# EasyEDA Pro project libre_oven_devkit.eprj

# Schematic Schematic1
Board Name: Board1; Create Date: 2026-02-06; Page Name: P1; Project Name: libre_oven_devkit; Schematic Name: Schematic1; Update Date: 2026-02-27; Company: EasyEDA.com; Page Size: A4; Version: V1.0
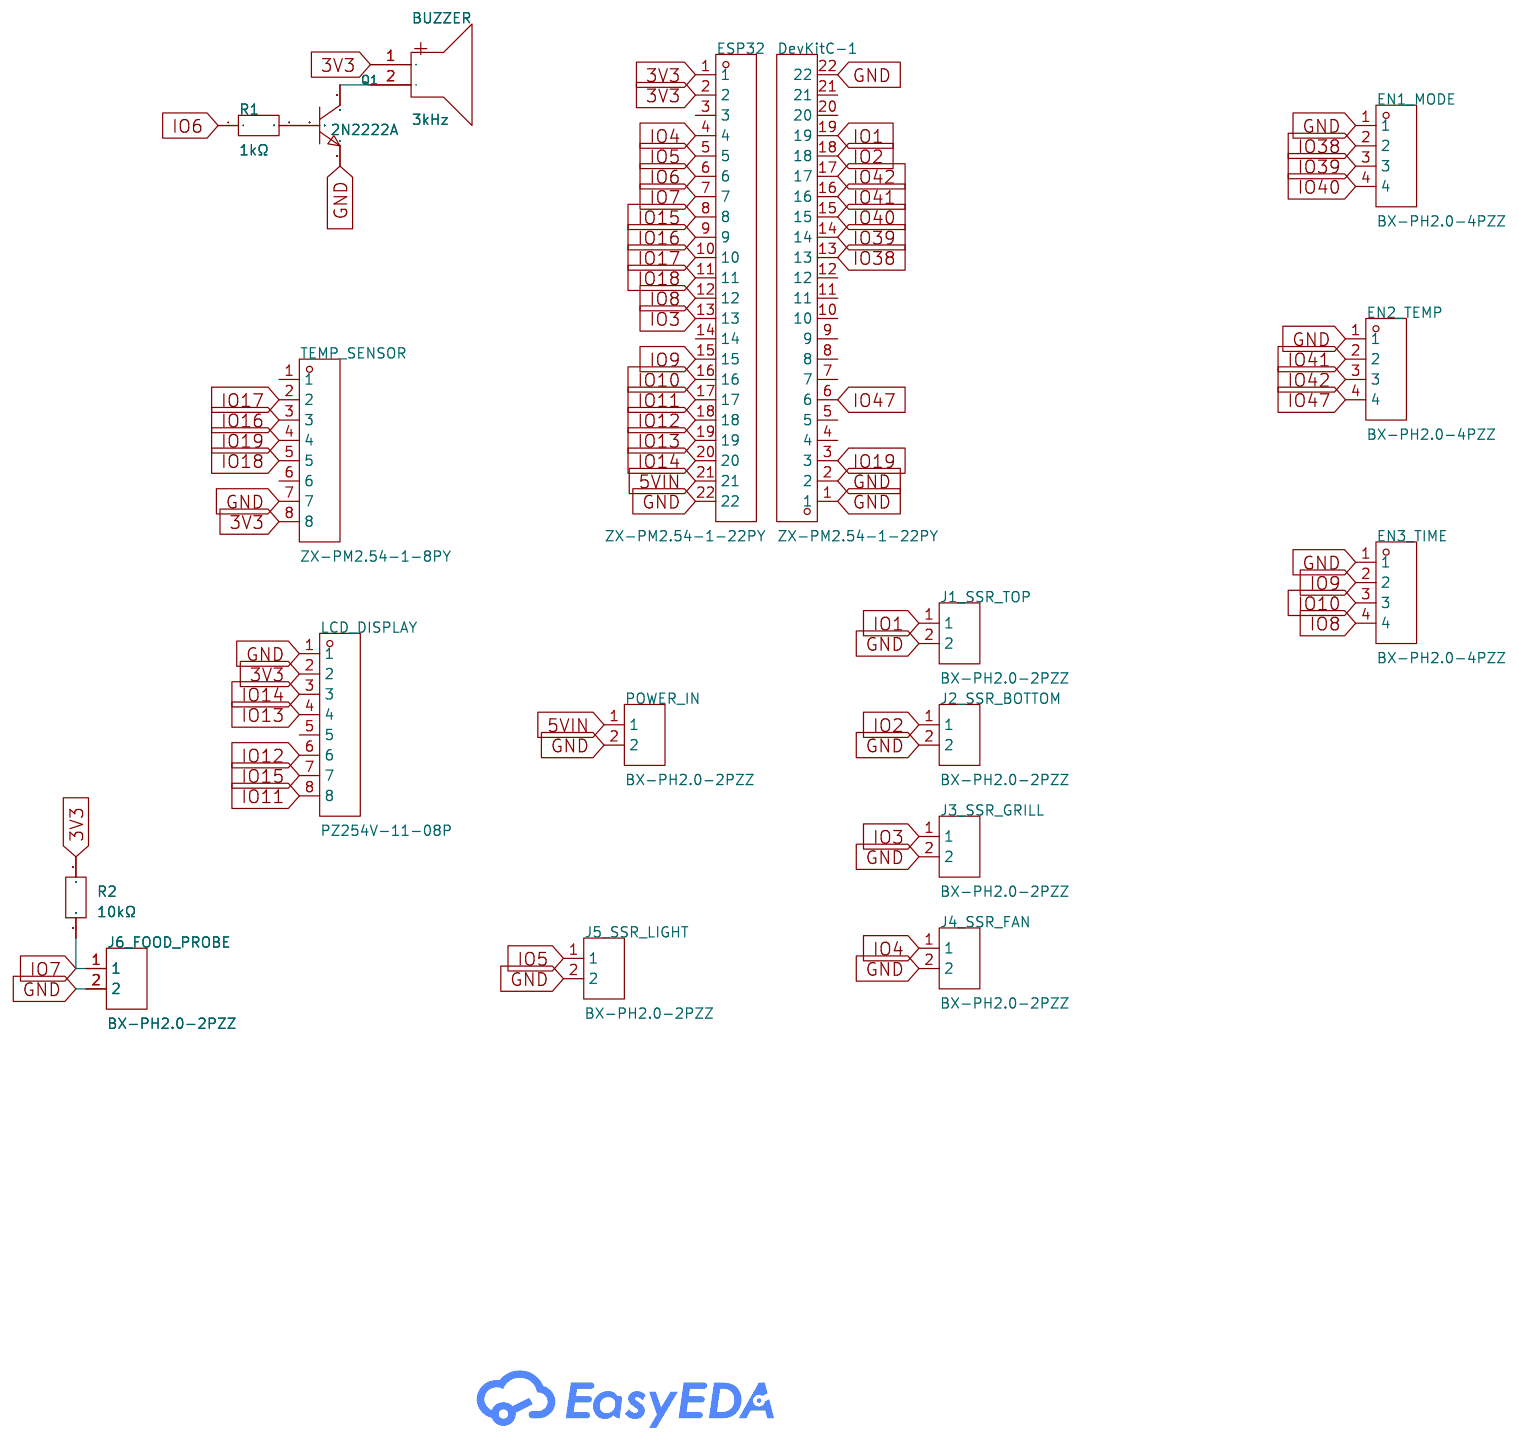
[diagram p0: schematic sheet]

## Parts
BUZZER  3kHz  [BUZ-TH_BD9.0-P5.00-D0.6-FD]
DevKitC-1  ZX-PM2.54-1-22PY  [HDR-TH_22P-P2.54-V-F]
EN1_MODE  BX-PH2.0-4PZZ  [CONN-TH_4P-P2.00_BX-PH2.0-4PZZ]
EN2_TEMP  BX-PH2.0-4PZZ  [CONN-TH_4P-P2.00_BX-PH2.0-4PZZ]
EN3_TIME  BX-PH2.0-4PZZ  [CONN-TH_4P-P2.00_BX-PH2.0-4PZZ]
ESP32  ZX-PM2.54-1-22PY  [HDR-TH_22P-P2.54-V-F]
J1_SSR_TOP  BX-PH2.0-2PZZ  [CONN-TH_2P-P2.00_BOSSIE_BX-PH2.0-2PZZ]
J2_SSR_BOTTOM  BX-PH2.0-2PZZ  [CONN-TH_2P-P2.00_BOSSIE_BX-PH2.0-2PZZ]
J3_SSR_GRILL  BX-PH2.0-2PZZ  [CONN-TH_2P-P2.00_BOSSIE_BX-PH2.0-2PZZ]
J4_SSR_FAN  BX-PH2.0-2PZZ  [CONN-TH_2P-P2.00_BOSSIE_BX-PH2.0-2PZZ]
J5_SSR_LIGHT  BX-PH2.0-2PZZ  [CONN-TH_2P-P2.00_BOSSIE_BX-PH2.0-2PZZ]
J6_FOOD_PROBE  BX-PH2.0-2PZZ  [CONN-TH_2P-P2.00_BOSSIE_BX-PH2.0-2PZZ]
LCD_DISPLAY  PZ254V-11-08P  [HDR-TH_8P-P2.54-V-M]
POWER_IN  BX-PH2.0-2PZZ  [CONN-TH_2P-P2.00_BOSSIE_BX-PH2.0-2PZZ]
Q1  2N2222A  [TO-92-3_L4.9-W3.7-P1.27-L]
R1  1kΩ  [RES-TH_BD2.7-L6.2-P10.20-D0.4]
R2  10kΩ  [RES-TH_BD2.7-L6.2-P10.20-D0.4]
TEMP_SENSOR  ZX-PM2.54-1-8PY  [HDR-TH_8P-P2.54-V-F]

## Library data of the parts
BUZZER = HNB09A03: LCSC Part Name: 电磁式有源一体蜂鸣器HNB09A03; Supplier Part: C96102; Manufacturer: 华能; Supplier Footprint: 插件,D=9mm; JLCPCB Part Class: Extended Part; Datasheet: https://item.szlcsc.com/datasheet/HNB09A03/97306.html; Supplier: LCSC; Driver Circuitry: Active Buzzer (Built-in Driving Circuit); Technology: Electromagnetic; Voltage - Supply: 1.5V~4.5V; Current Consumption: 30mA; Sound Pressure Level(SPL): 85dB; Diameter(φD): 9mm; Height: 5.5mm; Operating Temperature: -20℃~+70℃
DevKitC-1 ESP32 = ZX-PM2.54-1-22PY: LCSC Part Name: 1x22P 间距:2.54mm 直插; Supplier Part: C7499337; Manufacturer: Megastar(兆星); Supplier Footprint: 插件,P=2.54mm; JLCPCB Part Class: Extended Part; Datasheet: https://item.szlcsc.com/datasheet/ZX-PM2.54-1-22PY/8573998.html; Supplier: LCSC; Holes Structure: 1x22P; Pitch: 2.54mm; Circular Hole / Square Hole: Square Hole; Mounting Type: Through Hole; Number of Rows: 1; Number of Positions: 22P; Current Rating: 3A; Holes Direction: Top; Insulation Height: 8.5mm; Contact Material: Brass; Contact Plating: Gold; Operating Temperature: -40℃~+105℃; PIN Length: 3.2mm
EN1_MODE EN2_TEMP EN3_TIME = BX-PH2.0-4PZZ: LCSC Part Name: 1x4P 间距:2mm 直插 系列:PH; Supplier Part: C18077746; Manufacturer: Bossie(博锡); Supplier Footprint: 插件,P=2mm; JLCPCB Part Class: Extended Part; Datasheet: https://item.szlcsc.com/datasheet/BX-PH2.0-4PZZ/19218147.html; Supplier: LCSC; Pins Structure: 1x4P; Pitch: 2mm; Mounting Type: Through Hole; Reference Series: PH; Number of Pins: 4P; Number of Rows: 1; Number of PINs Per Row: 4; Current Rating: 2A; Contact Material: Brass; Contact Plating: Tin; Operating Temperature: -25℃~+85℃; Voltage Rating: 250V; Plastic Material: PA66; Flame Retardant Rating: UL94V-0; Color: White; Z-Height of the Board: 6.05mm; X-Length of Bottom Edge on Board (Spacing Line): 10mm; Y-Width of Bottom Edge on Board: 4.7mm
J1_SSR_TOP J2_SSR_BOTTOM J3_SSR_GRILL J4_SSR_FAN J5_SSR_LIGHT J6_FOOD_PROBE POWER_IN = BX-PH2.0-2PZZ: LCSC Part Name: 1x2P 间距:2mm 直插 系列:PH; Supplier Part: C18077744; Manufacturer: Bossie(博锡); Supplier Footprint: 插件,P=2mm; JLCPCB Part Class: Extended Part; Datasheet: https://item.szlcsc.com/datasheet/BX-PH2.0-2PZZ/19218145.html; Supplier: LCSC; Pins Structure: 1x2P; Pitch: 2mm; Mounting Type: Through Hole; Reference Series: PH; Number of Pins: 2P; Number of Rows: 1; Number of PINs Per Row: 2; Current Rating: 2A; Contact Material: Brass; Contact Plating: Tin; Operating Temperature: -25℃~+85℃; Voltage Rating: 250V; Plastic Material: PA66; Flame Retardant Rating: UL94V-0; Color: White; Z-Height of the Board: 6.05mm; X-Length of Bottom Edge on Board (Spacing Line): 6mm; Y-Width of Bottom Edge on Board: 4.7mm
LCD_DISPLAY = PZ254V-11-08P: LCSC Part Name: 1x8P 间距:2.54mm 方针 直插; Supplier Part: C492407; Manufacturer: XFCN(兴飞); Supplier Footprint: 插件,P=2.54mm; JLCPCB Part Class: Extended Part; Datasheet: https://item.szlcsc.com/datasheet/PZ254V-11-08P/502963.html; Supplier: LCSC; Pin Structure: 1x8P; Pitch: 2.54mm; Circluar Pins/Square Pins: Pin Header; Mounting Type: Through Hole; Number of Rows: 1; Number of Pins: 8P; Length of Mating Pin: 6mm; Insulation Height: 2.5mm; Length of End Connection Pin: 3mm; Contact Material: Brass; Operating Temperature: -40℃~+105℃; Color: Black
Q1 = 2N2222A_C118536: LCSC Part Name: NPN 电流:600mA 电压:40V; Supplier Part: C118536; Manufacturer: ST(先科); Supplier Footprint: TO-92; JLCPCB Part Class: Extended Part; Datasheet: https://item.szlcsc.com/datasheet/2N2222A/119803.html; Supplier: LCSC; type: NPN; Current - Collector(Ic): 600mA; Collector - Emitter Voltage VCEO: 40V; Pd - Power Dissipation: 625mW; DC Current Gain: 40@500mA,10V; Transition frequency(fT): 250MHz; Current - Collector Cutoff: 10nA; Vce Saturation(VCE(sat)): 1V; Emitter-Base Voltage(Vebo): 6V; Number: 1 NPN
R1 R2 = MF1/4W-1K±1%-ST52: LCSC Part Name: 金属膜电阻 1kΩ ±1% 250mW; Supplier Part: C2903245; Manufacturer: VO(翔胜); Supplier Footprint: 插件,D2.7xL6.2mm; JLCPCB Part Class: Extended Part; Datasheet: https://item.szlcsc.com/datasheet/MF1%252F4W-1K%25C2%25B11%2525-ST52/3158996.html; Supplier: LCSC; Type: Metal Film Resistor; Tolerance: ±1%; Voltage-Supply(Max): 250V; Power(Watts): 250mW; Temperature Coefficient: ±100ppm/℃; Operating Temperature: -55℃~+155℃
TEMP_SENSOR = ZX-PM2.54-1-8PY: LCSC Part Name: 1x8P 间距:2.54mm 直插; Supplier Part: C7499328; Manufacturer: Megastar(兆星); Supplier Footprint: 插件,P=2.54mm; JLCPCB Part Class: Extended Part; Datasheet: https://item.szlcsc.com/datasheet/ZX-PM2.54-1-8PY/8573989.html; Supplier: LCSC; Holes Structure: 1x8P; Pitch: 2.54mm; Circular Hole / Square Hole: Square Hole; Mounting Type: Through Hole; Number of Rows: 1; Number of Positions: 8P; Current Rating: 3A; Holes Direction: Top; Insulation Height: 8.5mm; Contact Material: Brass; Contact Plating: Gold; Operating Temperature: -40℃~+105℃; PIN Length: 3.2mm

## Nets
3V3: BUZZER.1(+) ESP32.1 ESP32.2 LCD_DISPLAY.2 R2.1 TEMP_SENSOR.8
5VIN: ESP32.21 POWER_IN.1
GND: DevKitC-1.1 DevKitC-1.2 DevKitC-1.22 EN1_MODE.1 EN2_TEMP.1 EN3_TIME.1 ESP32.22 J1_SSR_TOP.2 J2_SSR_BOTTOM.2 J3_SSR_GRILL.2 J4_SSR_FAN.2 J5_SSR_LIGHT.2 J6_FOOD_PROBE.2 LCD_DISPLAY.1 POWER_IN.2 Q1.1(E) TEMP_SENSOR.7
IO1: DevKitC-1.19 J1_SSR_TOP.1
IO2: DevKitC-1.18 J2_SSR_BOTTOM.1
IO3: ESP32.13 J3_SSR_GRILL.1
IO4: ESP32.4 J4_SSR_FAN.1
IO5: ESP32.5 J5_SSR_LIGHT.1
IO6: ESP32.6 R1.1
IO7: ESP32.7 J6_FOOD_PROBE.1 R2.2
IO8: EN3_TIME.4 ESP32.12
IO9: EN3_TIME.2 ESP32.15
IO10: EN3_TIME.3 ESP32.16
IO11: ESP32.17 LCD_DISPLAY.8
IO12: ESP32.18 LCD_DISPLAY.6
IO13: ESP32.19 LCD_DISPLAY.4
IO14: ESP32.20 LCD_DISPLAY.3
IO15: ESP32.8 LCD_DISPLAY.7
IO16: ESP32.9 TEMP_SENSOR.3
IO17: ESP32.10 TEMP_SENSOR.2
IO18: ESP32.11 TEMP_SENSOR.5
IO19: DevKitC-1.3 TEMP_SENSOR.4
IO38: DevKitC-1.13 EN1_MODE.2
IO39: DevKitC-1.14 EN1_MODE.3
IO40: DevKitC-1.15 EN1_MODE.4
IO41: DevKitC-1.16 EN2_TEMP.2
IO42: DevKitC-1.17 EN2_TEMP.3
IO47: DevKitC-1.6 EN2_TEMP.4
$1N1097: BUZZER.2(-) Q1.3(C)
$1N1205: Q1.2(B) R1.2

Not connected (* = marked no-connect by the designer): DevKitC-1 4 5 7 8 9 10 11 12 20 21; ESP32 3 14; LCD_DISPLAY 5; TEMP_SENSOR 1 6

# Board PCB1
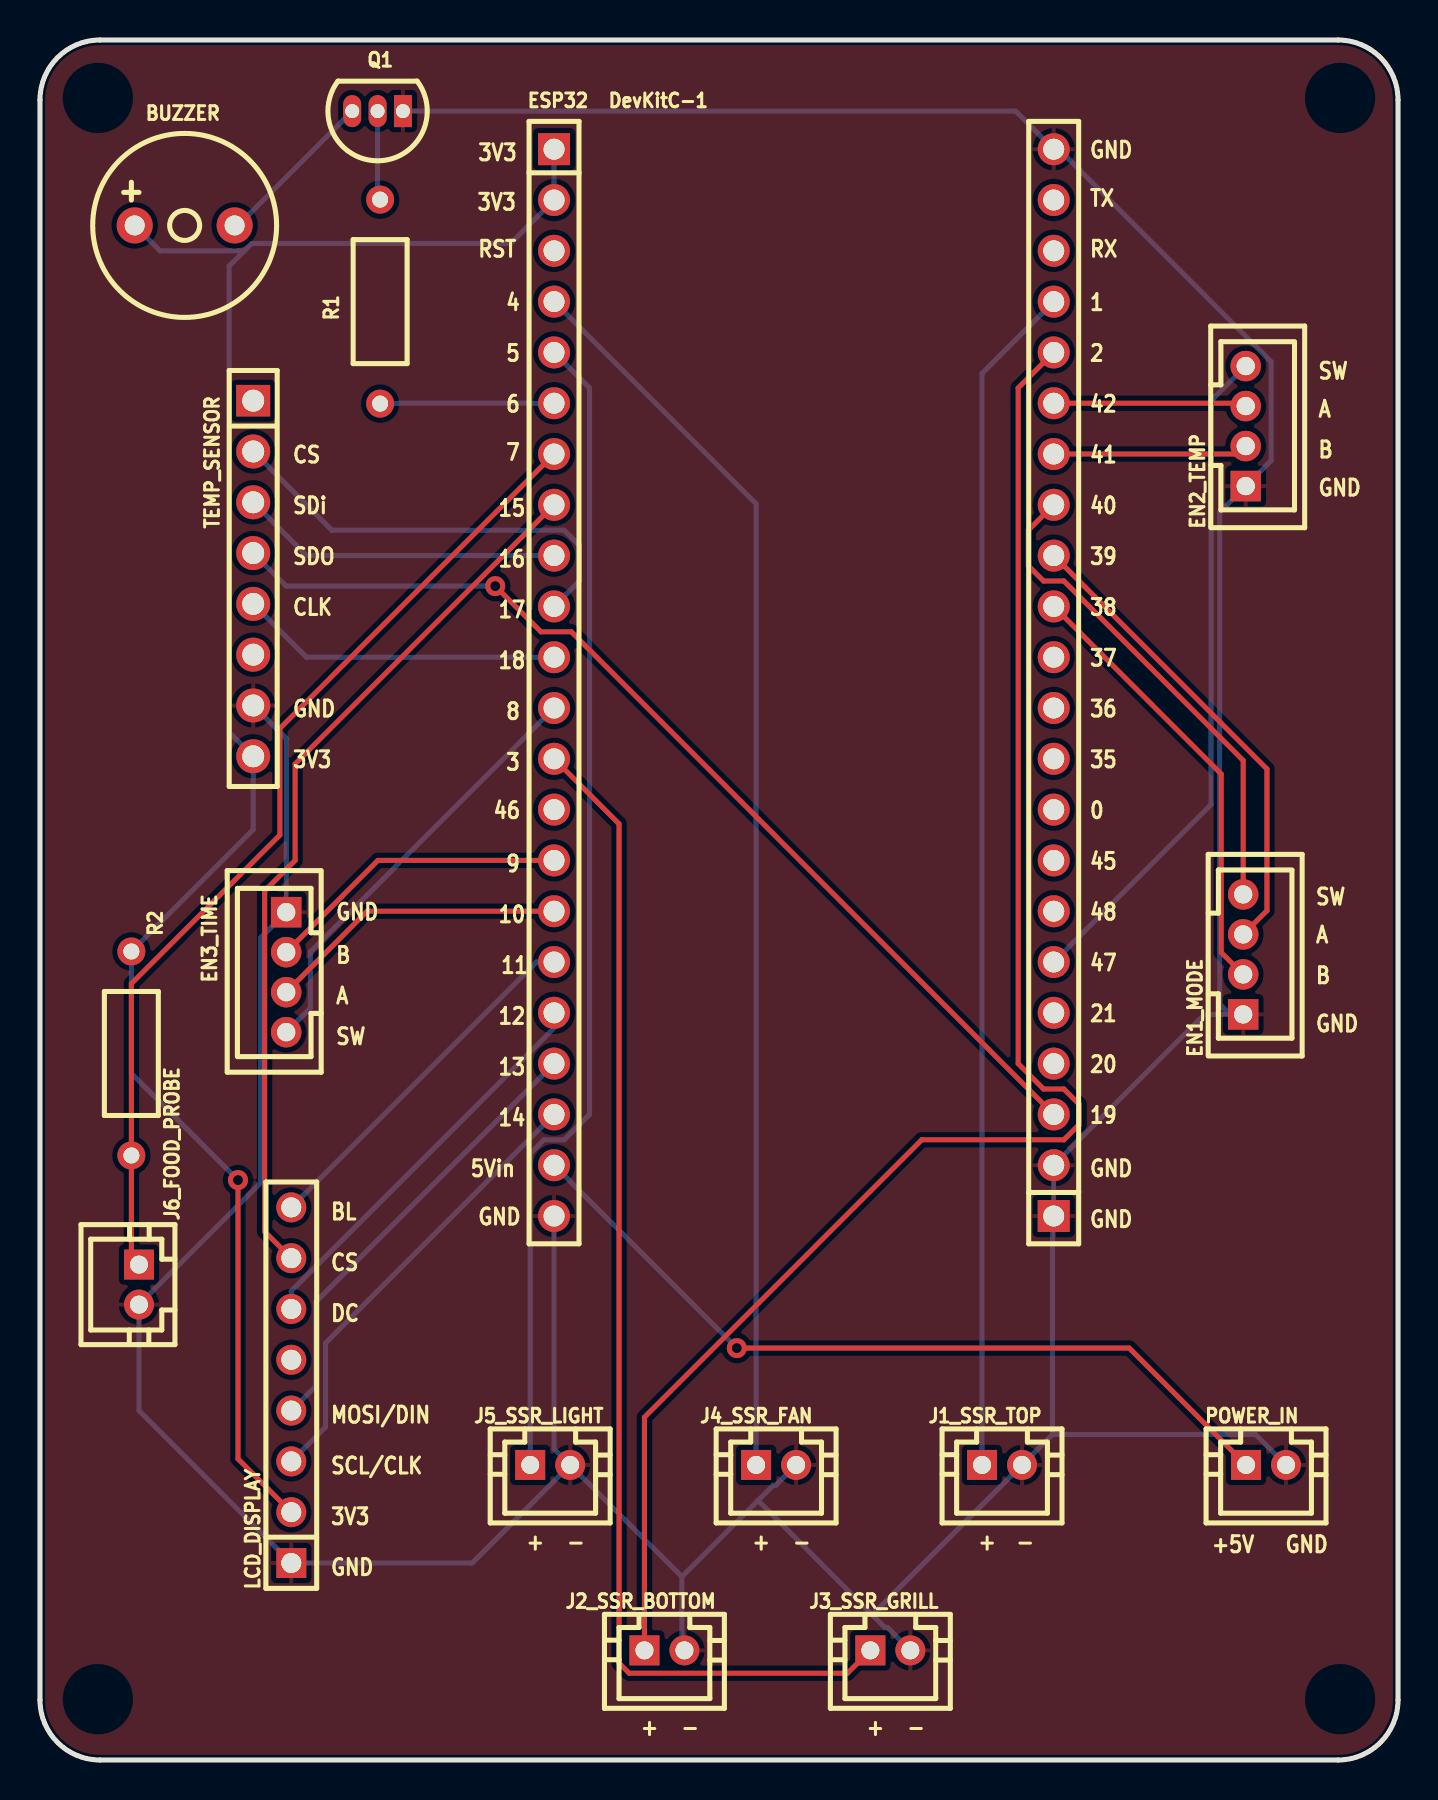
[diagram p1: board, top side]
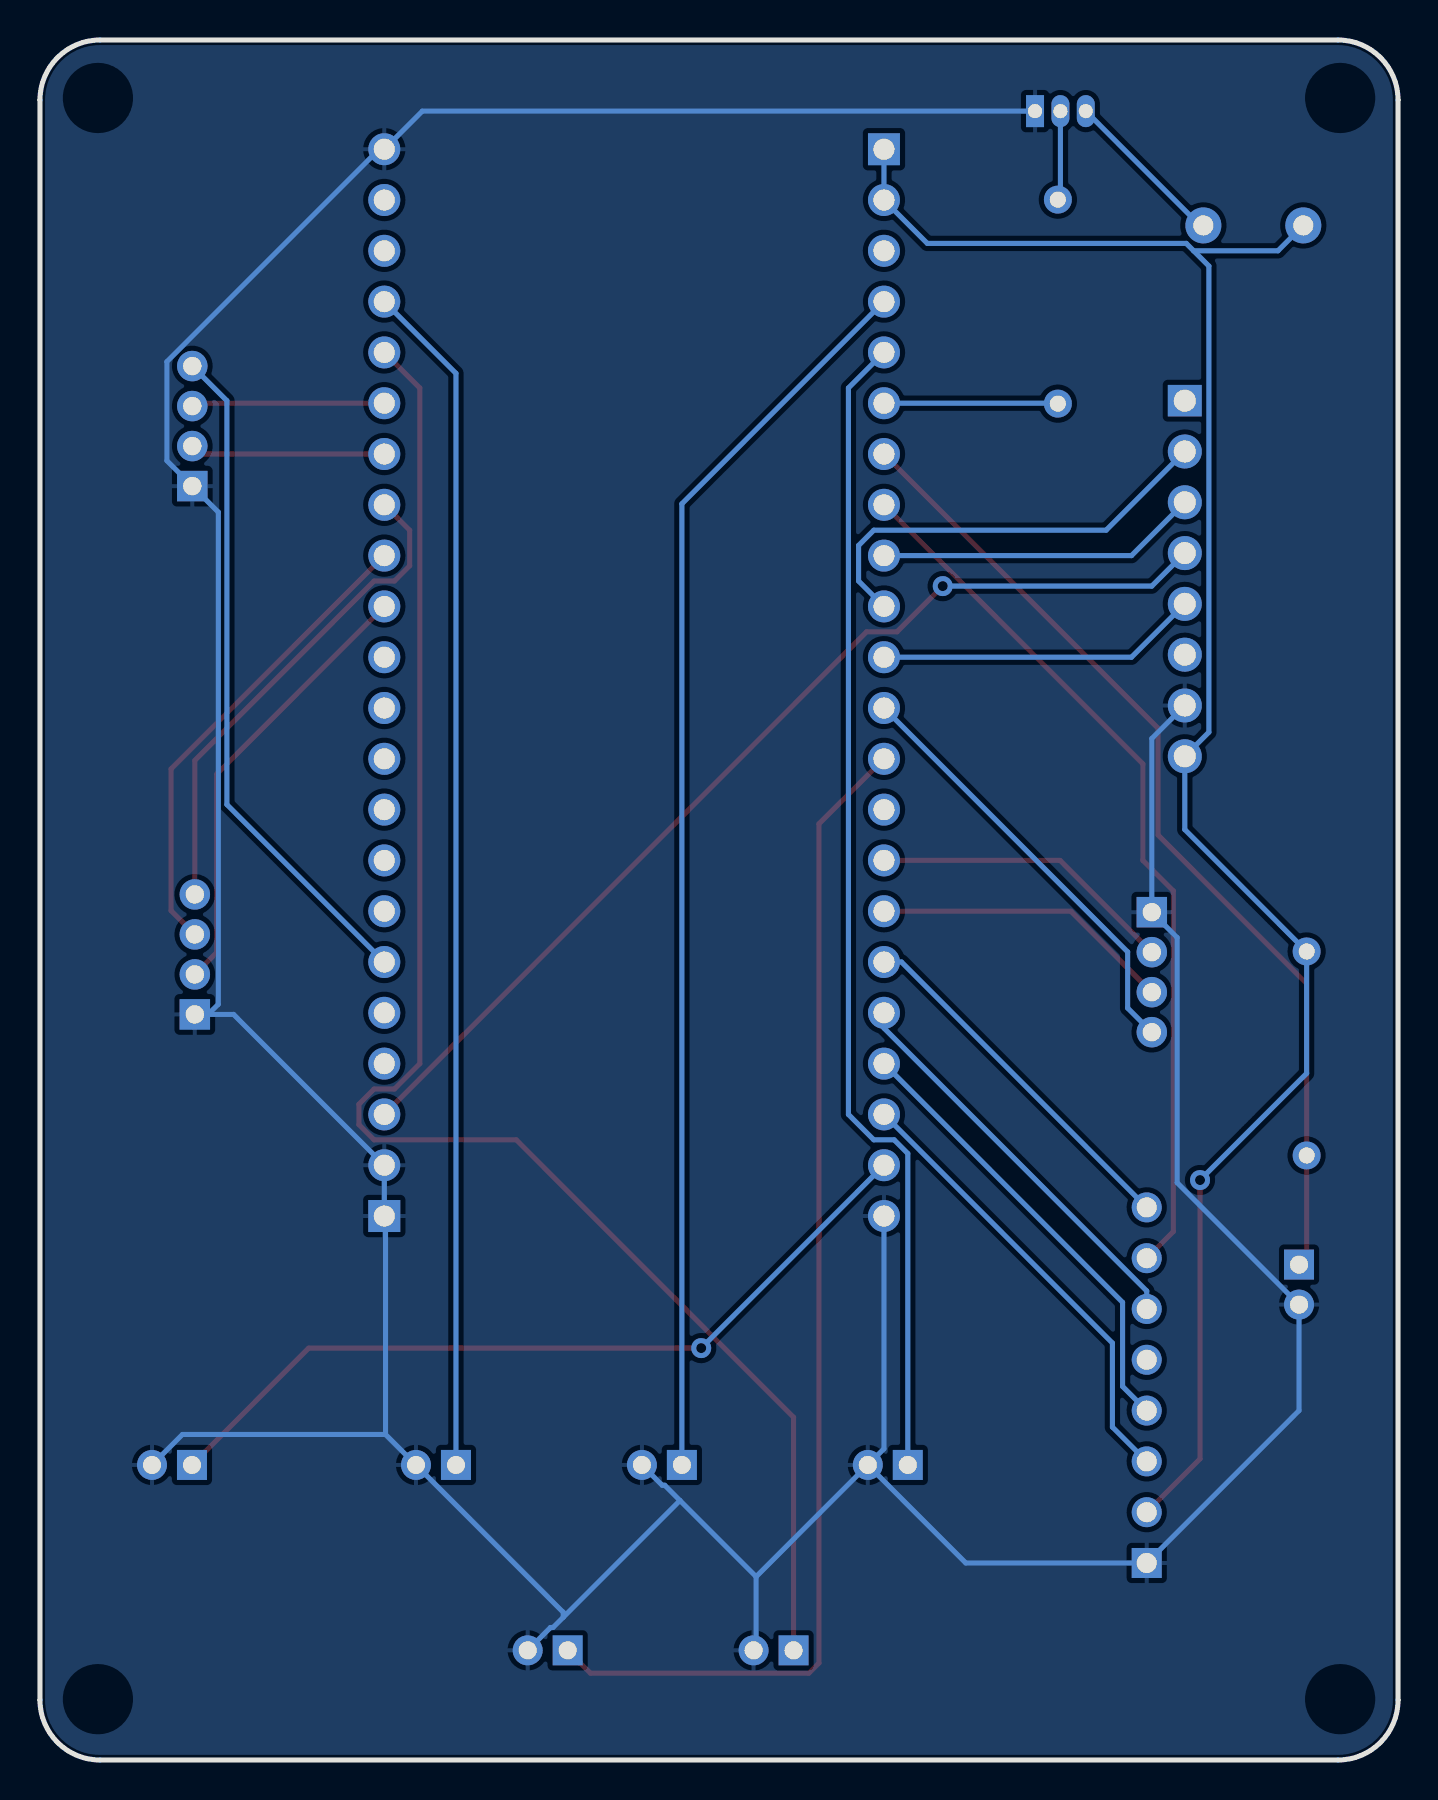
[diagram p2: board, bottom side, seen from below]

Outline 67.94 x 86 mm; copper layers: Top Layer, Bottom Layer. Coordinates in mm from the lower left corner of the outline.
Outline path: 0,83 0,3 arc(0.88,0.88) 3,0 64.94,0 arc(67.07,0.88) 67.94,3 67.94,83 arc(67.07,85.12) 64.94,86 3,86 arc(0.88,85.12) 0,83
Stack: Top Layer 0.035mm / Dielectric1 1.51mm FR4 er 4.5 / Bottom Layer 0.035mm

## Design rules (mm)
template: Custom Config
spacing copperThickness1oz (default): track to track 0.102, other pairs 0.152 to 0.3
spacing copperThickness2oz: track to track 0.203, other pairs 0.152 to 0.3
spacing safeClearance1: track to track 0.4, other pairs 0.152 to 0.3
track width copperThickness1oz (default): min 0.102, default 0.254, max 2.54
track width copperThickness2oz: min 0.203, default 0.254, max 2.54
differential pair differentialPair (default): width min 0.127, default 0.254, max 2.54; gap min 0.152, default 0.152
via viaSize (default): diameter min 0.5, default 1, max 10; hole min 0.3, default 0.5, max 6.3

## Placement (name value [footprint] x y rotation side)
BUZZER  3kHz  [BUZ-TH_BD9.0-P5.00-D0.6-FD]  7.24 76.73 0 top
DevKitC-1  ZX-PM2.54-1-22PY  [HDR-TH_22P-P2.54-V-F]  50.72 53.87 90 top
EN1_MODE  BX-PH2.0-4PZZ  [CONN-TH_4P-P2.00_BX-PH2.0-4PZZ]  60.2 40.28 90 top
EN2_TEMP  BX-PH2.0-4PZZ  [CONN-TH_4P-P2.00_BX-PH2.0-4PZZ]  60.32 66.7 90 top
EN3_TIME  BX-PH2.0-4PZZ  [CONN-TH_4P-P2.00_BX-PH2.0-4PZZ]  12.32 39.39 270 top
ESP32  ZX-PM2.54-1-22PY  [HDR-TH_22P-P2.54-V-F]  25.72 53.87 270 top
J1_SSR_TOP  BX-PH2.0-2PZZ  [CONN-TH_2P-P2.00_BOSSIE_BX-PH2.0-2PZZ]  48.13 14.75 0 top
J2_SSR_BOTTOM  BX-PH2.0-2PZZ  [CONN-TH_2P-P2.00_BOSSIE_BX-PH2.0-2PZZ]  31.24 5.48 0 top
J3_SSR_GRILL  BX-PH2.0-2PZZ  [CONN-TH_2P-P2.00_BOSSIE_BX-PH2.0-2PZZ]  42.54 5.48 0 top
J4_SSR_FAN  BX-PH2.0-2PZZ  [CONN-TH_2P-P2.00_BOSSIE_BX-PH2.0-2PZZ]  36.83 14.75 0 top
J5_SSR_LIGHT  BX-PH2.0-2PZZ  [CONN-TH_2P-P2.00_BOSSIE_BX-PH2.0-2PZZ]  25.53 14.75 0 top
J6_FOOD_PROBE  BX-PH2.0-2PZZ  [CONN-TH_2P-P2.00_BOSSIE_BX-PH2.0-2PZZ]  4.95 23.77 270 top
LCD_DISPLAY  PZ254V-11-08P  [HDR-TH_8P-P2.54-V-M]  12.57 18.74 90 top
POWER_IN  BX-PH2.0-2PZZ  [CONN-TH_2P-P2.00_BOSSIE_BX-PH2.0-2PZZ]  61.34 14.75 0 top
Q1  2N2222A  [TO-92-3_L4.9-W3.7-P1.27-L]  16.89 82.44 180 top
R1  1kΩ  [RES-TH_BD2.7-L6.2-P10.20-D0.4]  17.02 72.92 90 top
R2  10kΩ  [RES-TH_BD2.7-L6.2-P10.20-D0.4]  4.57 35.33 270 top
TEMP_SENSOR  ZX-PM2.54-1-8PY  [HDR-TH_8P-P2.54-V-F]  10.67 59.08 270 top

## Footprints (pads in the part's own frame, mm; a bottom-side part is the same pattern mirrored in y, then rotated)
BUZ-TH_BD9.0-P5.00-D0.6-FD
  round 1.8 hole 1: 1(-2.5,0) 2(2.5,0)
CONN-TH_2P-P2.00_BOSSIE_BX-PH2.0-2PZZ
  rect 1.5x1.5 hole 0.9: 1(-1,0)
  round 1.5 hole 0.9: 2(1,0)
CONN-TH_4P-P2.00_BX-PH2.0-4PZZ
  rect 1.524x1.524 hole 0.914: 1(-3,0)
  round 1.524 hole 0.914: 2(-1,0) 3(1,0) 4(3,0)
HDR-TH_8P-P2.54-V-F
  rect 1.575x1.7 hole 1.1: 1(-8.89,0)
  round 1.7 hole 1.1: 2(-6.35,0) 3(-3.81,0) 4(-1.27,0) 5(1.27,0) 6(3.81,0) 7(6.35,0) 8(8.89,0)
HDR-TH_8P-P2.54-V-M
  rect 1.5x1.5 hole 1: 1(-8.89,0)
  round 1.5 hole 1: 2(-6.35,0) 3(-3.81,0) 4(-1.27,0) 5(1.27,0) 6(3.81,0) 7(6.35,0) 8(8.89,0)
HDR-TH_22P-P2.54-V-F
  rect 1.6x1.6 hole 1.05: 1(-26.67,0)
  round 1.6 hole 1.05: 2(-24.13,0) 3(-21.59,0) 4(-19.05,0) 5(-16.51,0) 6(-13.97,0) 7(-11.43,0) 8(-8.89,0) 9(-6.35,0) 10(-3.81,0) 11(-1.27,0) 12(1.27,0) 13(3.81,0) 14(6.35,0) 15(8.89,0) 16(11.43,0) 17(13.97,0) 18(16.51,0) 19(19.05,0) 20(21.59,0) 21(24.13,0) 22(26.67,0)
RES-TH_BD2.7-L6.2-P10.20-D0.4
  round 1.4 hole 0.8: 1(-5.1,0) 2(5.1,0)
TO-92-3_L4.9-W3.7-P1.27-L
  rect 0.9x1.6 hole 0.7: 1(-1.27,0)
  oval 0.9x1.6 hole 0.7: 2(0,0) 3(1.27,0)

## Nets
As in the schematic.

Pads without a net: DevKitC-1 4 5 7 8 9 10 11 12 20 21; ESP32 3 14; LCD_DISPLAY 5; TEMP_SENSOR 1 6

## Via types
v1: diameter 1, hole 0.5, Top Layer to Bottom Layer, 3 vias

## Routing (per net, layer and track width the routed paths; a pad name or vN(x,y) marks a point on that pad's centre or on a via; arc(x,y) is an arc through that point)
3V3: length 94.8
  Top Layer w0.254: LCD_DISPLAY.2 9.91,15.06 v1(9.91,29)
  Bottom Layer w0.254: ESP32.1 25.72,78 23.55,75.83 10.6,75.83 10.22,75.46 ; 10.22,75.46 6.01,75.46 BUZZER.1 ; 10.22,75.46 9.46,74.7 9.46,51.39 TEMP_SENSOR.8 10.67,46.52 4.57,40.43 4.57,34.33 v1(9.91,29)
5VIN: length 40.8
  Top Layer w0.254: POWER_IN.1 54.5,20.59 v1(34.86,20.59)
  Bottom Layer w0.254: ESP32.21 v1(34.86,20.59)
GND: length 242.7
  Bottom Layer w0.254: 35.92,12.97 41.77,7.13 ; 35.92,12.97 36.69,13.74 36.81,13.74 J4_SSR_FAN.2 ; 35.92,12.97 32.11,9.16 ; 41.77,7.13 41.77,7.39 J1_SSR_TOP.2 50.66,16.28 ; 41.77,7.13 42.28,6.62 42.4,6.62 J3_SSR_GRILL.2 ; 59.53,37.28 59.02,37.79 59.02,62.39 EN2_TEMP.1 61.59,64.97 61.59,69.92 50.97,80.54 DevKitC-1.22 48.81,82.44 Q1.1 ; 59.53,37.28 58.26,37.28 DevKitC-1.2 DevKitC-1.1 50.66,27.14 50.66,16.28 ; 59.53,37.28 EN1_MODE.1 ; 50.66,16.28 60.82,16.28 POWER_IN.2 ; J5_SSR_LIGHT.2 21.62,9.85 12.57,9.85 4.95,17.47 J6_FOOD_PROBE.2 11.05,28.87 11.05,41.12 EN3_TIME.1 12.32,51.07 TEMP_SENSOR.7 ; J5_SSR_LIGHT.2 32.11,9.16 ; J5_SSR_LIGHT.2 25.72,15.56 ESP32.22 ; 32.11,9.16 32.11,5.61 J2_SSR_BOTTOM.2
IO1: length 59.7
  Bottom Layer w0.254: 50.72,72.92 47.13,69.33 J1_SSR_TOP.1
IO2: length 80.7
  Top Layer w0.254: DevKitC-1.18 48.94,68.6 48.94,34.82 50.21,33.55 51.23,33.55 51.99,32.79 51.99,31.77 51.23,31.01 44.11,31.01 30.24,17.14 J2_SSR_BOTTOM.1
IO3: length 59.8
  Top Layer w0.254: 25.72,50.06 28.97,46.81 28.97,4.85 29.48,4.34 40.4,4.34 J3_SSR_GRILL.1
IO4: length 62.4
  Bottom Layer w0.254: 25.72,72.92 35.83,62.81 J4_SSR_FAN.1
IO5: length 58.2
  Bottom Layer w0.254: ESP32.5 27.5,68.6 27.5,32.28 26.23,31.01 25.21,31.01 24.53,30.32 J5_SSR_LIGHT.1
IO6: length 8.7
  Bottom Layer w0.254: R1.1 17.04,67.84 ESP32.6
IO7: length 49.4
  Top Layer w0.254: 25.72,65.3 12,51.58 12,46.25 4.57,38.82 R2.2 4.57,25.15 J6_FOOD_PROBE.1
IO8: length 21.8
  Bottom Layer w0.254: EN3_TIME.4 13.53,37.6 13.53,40.41 ESP32.12
IO9: length 15.3
  Top Layer w0.254: EN3_TIME.2 16.91,44.98 ESP32.15
IO10: length 15.1
  Top Layer w0.254: EN3_TIME.3 16.37,42.44 ESP32.16
IO11: length 18.2
  Bottom Layer w0.254: ESP32.17 24.84,39.9 LCD_DISPLAY.8
IO12: length 20.3
  Bottom Layer w0.254: 25.72,37.36 25.72,36.6 12.57,23.45 LCD_DISPLAY.6
IO13: length 22.8
  Bottom Layer w0.254: LCD_DISPLAY.4 13.78,18.68 13.78,22.88 ESP32.19
IO14: length 22.8
  Bottom Layer w0.254: LCD_DISPLAY.3 14.29,16.65 14.29,20.85 25.72,32.28
IO15: length 44.2
  Top Layer w0.254: 12.57,25.09 11.24,26.42 11.24,43.45 12.77,44.98 12.77,49.8 ESP32.8
IO16: length 16.2
  Bottom Layer w0.254: 25.72,60.22 13.33,60.22 TEMP_SENSOR.3
IO17: length 21.8
  Bottom Layer w0.254: ESP32.10 26.99,58.95 26.99,60.73 26.23,61.49 14.6,61.49 TEMP_SENSOR.2
IO18: length 16.2
  Bottom Layer w0.254: 25.72,55.14 13.33,55.14 TEMP_SENSOR.5
IO19: length 51.7
  Top Layer w0.254: v1(22.78,58.69) 25.06,56.41 26.59,56.41 50.72,32.28
  Bottom Layer w0.254: v1(22.78,58.69) 12.32,58.69 TEMP_SENSOR.4
IO38: length 22.3
  Top Layer w0.254: DevKitC-1.13 59.1,49.3 59.1,40.38 EN1_MODE.2
IO39: length 23.9
  Top Layer w0.254: EN1_MODE.3 61.39,42.47 61.39,49.55 50.72,60.22
IO40: length 25.1
  Top Layer w0.254: DevKitC-1.15 49.45,61.49 49.45,59.71 50.21,58.95 51.23,58.95 60.2,49.98 EN1_MODE.4
IO41: length 9.8
  Top Layer w0.254: EN2_TEMP.2 59.93,65.3 50.72,65.3
IO42: length 9.7
  Top Layer w0.254: DevKitC-1.17 60.18,67.84 EN2_TEMP.3
IO47: length 33.8
  Bottom Layer w0.254: DevKitC-1.6 58.59,47.77 58.59,67.96 EN2_TEMP.4
$1N1097: length 8.2
  Bottom Layer w0.254: Q1.3 9.91,76.73 BUZZER.2
$1N1205: length 4.5
  Bottom Layer w0.254: Q1.2 16.89,78.15 R1.2

## Copper pours and planes (outline as drawn; the poured copper is in the pictures)
GND on Top Layer: -1.27,87.4 68.96,87.4 68.96,-0.61 -1.27,-0.61
GND on Bottom Layer: -1.14,87.14 69.47,87.14 69.47,-1.12 -1.14,-1.12

## Text on the board
Top Silkscreen Layer: CS | SDi | SDO | CLK | GND | 3V3 | BL | DC | MOSI/DIN | SCL/CLK | 5Vin | RST | 46 | 15 | 16 | 17 | 18 | 10 | 12 | 13 | 14 | 11 | 4 | 5 | 6 | 7 | 8 | 3 | 9 | + | - | TX | RX | 1 | 2 | 42 | 41 | 40 | 39 | 38 | 37 | 36 | 35 | 0 | 45 | 48 | 47 | 21 | 20 | 19 | +5V | SW | A | B
